# EAGLE design LiPoBatteryBreadboardSupply (EAGLE 8.2.2)
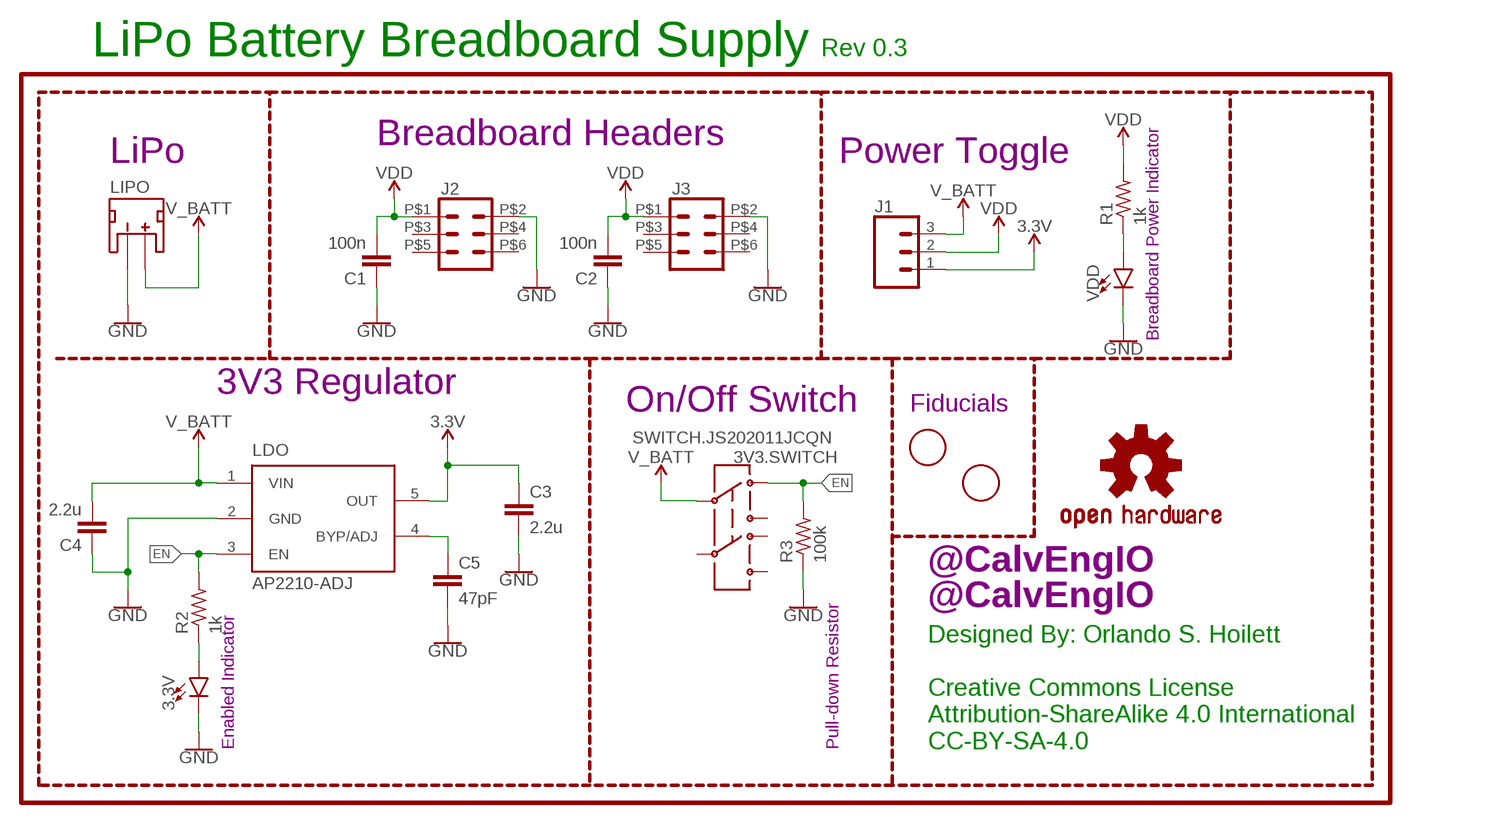
[diagram p0: schematic, sheet 1]

## Parts
3.3V  LED0603  [LED-0603]
3V3.SWITCH  SWITCH.JS202011JCQN  [SWITCH.00]
C1  100n  CAPACITOR0603  [C0603]
C2  100n  CAPACITOR0603  [C0603]
C3  2.2u  C-EUC0603  [C0603]
C4  2.2u  C-EUC0603  [C0603]
C5  47pF  C-EUC0402  [C0402]
FD1  FIDUCIAL  [FIDUCIAL_1MM]
FD2  FIDUCIAL  [FIDUCIAL_1MM]
J1  CONN_03  [1X03]
J2  JMP.03X2HEADERS  [JMP.03X2]
J3  JMP.03X2HEADERS  [JMP.03X2]
LDO  AP2210-ADJ  [SOT23-5]
LIPO  JST_2MM_MALE  [JST-2-SMD]
LOGO1  OSHW-LOGOS  [OSHW-LOGO-S]
R1  1k  R-US_R0402  [R0402]
R2  1k  R-US_R0402  [R0402]
R3  100k  R-US_R0402  [R0402]
U$1  HANDLE.1HANDLE.025  [HANDLE.025]
U$6  HANDLE.1HANDLE.08  [HANDLE.08]
VDD  LED0603  [LED-0603]

## Nets
3.3V: C3.1 J1.1 LDO.5(OUT)
EN: 3V3.SWITCH.1 LDO.3(EN) R2.2 R3.2
GND: 3.3V.C C1.1 C2.1 C3.2 C4.1 C5.2 J2.P$2 J3.P$2 LDO.2(GND) LIPO.1(-) R3.1 VDD.C
N$1: 3.3V.A R2.1
N$2: R1.1 VDD.A
N$4: C5.1 LDO.4(BYP/ADJ)
V_BATT: 3V3.SWITCH.2 C4.2 J1.3 LDO.1(VIN) LIPO.2(+)
VDD: C1.2 C2.2 J1.2 J2.P$1 J3.P$1 R1.2
Unconnected: 3V3.SWITCH.3 3V3.SWITCH.5 3V3.SWITCH.6 3V3.SWITCH.7 J2.P$3 J2.P$4 J2.P$5 J2.P$6 J3.P$3 J3.P$4 J3.P$5 J3.P$6 LIPO.NC1(PAD1) LIPO.NC2(PAD2)

## Notes on the sheet
- LiPo Battery Breadboard Supply | Rev 0.3
- Breadboard Headers
- LiPo | Power Toggle
- Breadboard Power Indicator
- 3V3 Regulator
- On/Off Switch | Fiducials
- Designed By: Orlando S. Hoilett
- Enabled Indicator | Pull-down Resistor
- Creative Commons License
  Attribution-ShareAlike 4.0 International
  CC-BY-SA-4.0

## Library data of the parts
3.3V VDD = CalvEngIO-LED:LED: LED (Generic) Standard schematic elements and footprints for 5mm, 3mm, 1206, and 0603 sized LEDs. Generic LEDs with no color specified.
3V3.SWITCH = CalvEngIO-Switches:SWITCH.JS202011JCQN
C1 C2 = CalvEngIO-Passives:CAPACITOR
C3-C5 = resistor:C-EU: CAPACITOR, European symbol
FD1 FD2 = adafruit:FIDUCIAL: For use by pick and place machines to calibrate the vision/machine, 1mm By microbuilder.eu
J1 = SparkFun-Connectors:CONN_03: Multi connection point. Often used as Generic Header-pin footprint for 0.1 inch spaced/style header connections On any of the 0.1 inch spaced packages, you can populate with these: Break Away Headers - Straight <https://www.sparkfun.com/products/116> (PRT-00116) Break Away Male Headers - Right Angle <https://www.sparkfun.com/products/553> (PRT-00553) Female Headers <https://www.sparkfun.com/products/115> (PRT-00115) Break Away Headers - Machine Pin <https://www.sparkfun.com/products/117> (PRT-00117) Break Away Female Headers - Swiss Machine Pin <https://www.sparkfun.com/products/743> (PRT-00743) Stackable Header - 3 Pin (Female, 0.1") <https://www.sparkfun.com/products/13875> (PRT-13875) For SCREWTERMINALS and SPRING TERMINALS visit here: Screw Terimnals on SparkFun.com <https://www.sparkfun.com/search/results?term=Screw+Terminals> (5mm/3.5mm/2.54mm spacing) This device is also useful as a general connection point to wire up your design to another part of your project. Our various solder wires solder well into these plated through hole pads. Hook-Up Wire - Assortment (Stranded, 22 AWG) <https://www.sparkfun.com/products/11375> (PRT-11375) Hook-Up Wire - Assortment (Solid Core, 22 AWG) <https://www.sparkfun.com/products/11367> (PRT-11367) View the entire wire category on our website here <https://www.sparkfun.com/categories/141> Special notes: Molex polarized connector foot print use with SKU : PRT-08232 with associated crimp pins and housings.
J2 J3 = CalvEngIO-Connectors:JMP.03X2: Multi connection point. Often used as Generic Header-pin footprint for 0.1 inch spaced/style header connections You can populate with any combo of single row headers, but if you'd like an exact match, check these: Header - 2x3 (Male, 0.1") <https://www.sparkfun.com/products/12807> (PRT-12807) Header - 2x3 (Female, 0.1") <https://www.sparkfun.com/products/13010> (PRT-13010) 2x3 Pin Shrouded Header <https://www.sparkfun.com/products/10877> (PRT-10877) On any of the 0.1 inch spaced packages, you can populate with these: Break Away Headers - Straight <https://www.sparkfun.com/products/116> (PRT-00116) Break Away Male Headers - Right Angle <https://www.sparkfun.com/products/553> (PRT-00553) Female Headers <https://www.sparkfun.com/products/115> (PRT-00115) Break Away Headers - Machine Pin <https://www.sparkfun.com/products/117> (PRT-00117) Break Away Female Headers - Swiss Machine Pin <https://www.sparkfun.com/products/743> (PRT-00743) Special note: the shrouded connector mates well with our 3x2 ribbon cables: Ribbon Crimp Connector - 6-pin (2x3, Female) <https://www.sparkfun.com/products/10651> (PRT-10651) Ribbon Cable - 6 wire (15ft) <https://www.sparkfun.com/products/10646> (PRT-10646); PROD_ID: HW-11044
LDO = CalvEngIO-Power:AP2210-ADJ
LIPO = SparkFun-Connectors:JST_2MM_MALE: JST 2MM MALE RA CONNECTOR Two pin, compact surface mount connector. Commonly used as a battery input connection point. We really like the solid locking feeling and high current rating on these small connectors. We use these all the time as battery connectors. Mates to single-cell LiPo batteries. Here is the connector we sell at SparkFun: JST Right Angle Connector - White <https://www.sparkfun.com/products/8612> (PRT-08612) Datasheet <http://www.sparkfun.com/datasheets/Prototyping/Connectors/JST-Horizontal.pdf> It was used on these SparkFun products: SparkFun MOSFET Power Controller <https://www.sparkfun.com/products/11214> (PRT-11214) SparkFun Battery Babysitter - LiPo Battery Manager <https://www.sparkfun.com/products/13777> (PRT-13777) And many, many others that required a lipo battery connection.; PROD_ID: CONN-11443; SF_ID: PRT-08612
LOGO1 = SparkFun-Aesthetics:OSHW-LOGO: Open-Source Hardware (OSHW) Logo This logo indicates the piece of hardware it is found on incorporates a OSHW license and/or adheres to the definition of open source hardware found here: http://freedomdefined.org/OSHW
R1-R3 = resistor:R-US_: RESISTOR, American symbol
U$1 U$6 = CalvEngIO-Logos:HANDLE.1

## Board
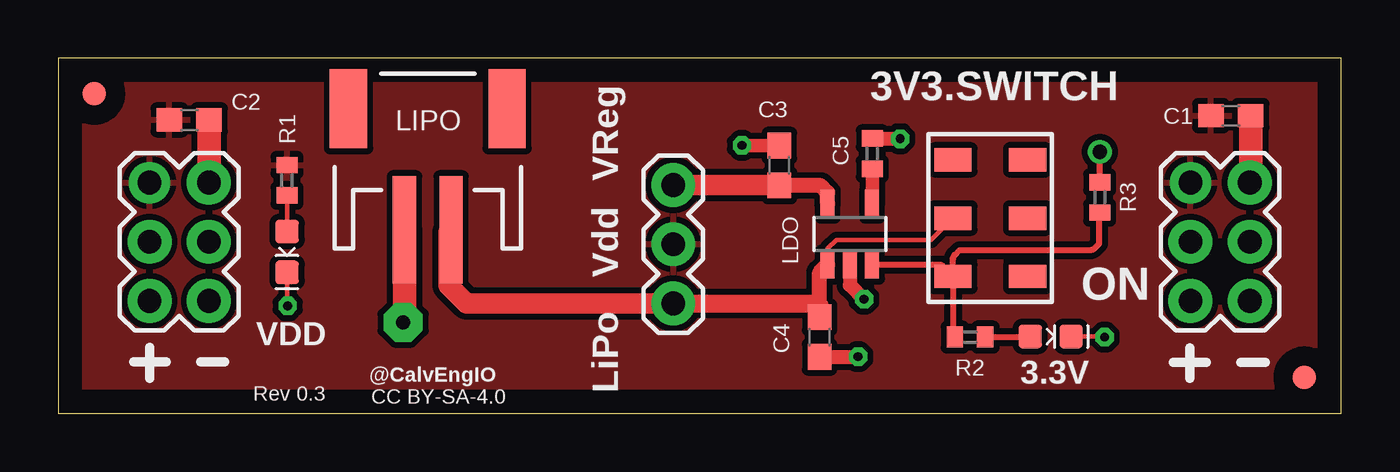
[diagram p1: board, top side]
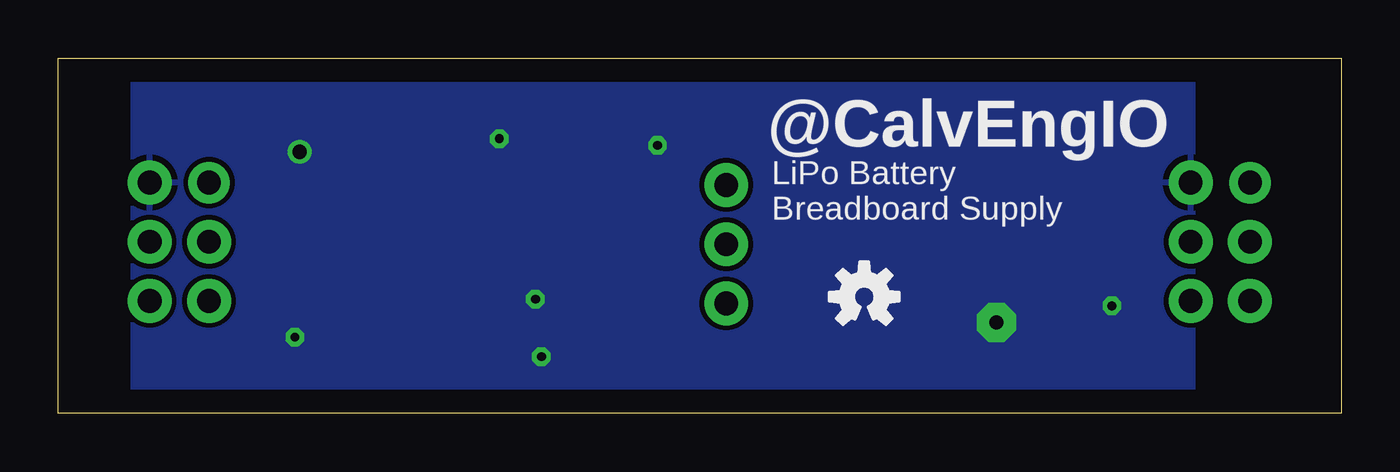
[diagram p2: board, bottom side, seen from below]

Size 55 x 15.24 mm. Coordinates in mm from the lower left corner, seen from the top.
Outline: 0,0 55,0 55,15.24 0,15.24 0,0
Copper layers (1*16): Top 0.035mm / dielectric 1.5mm / Bottom 0.035mm
Design rules "default": minimum track width 10mil, minimum drill 24mil, track to track 8mil, track to pad 8mil, pad to pad 8mil, via to via 8mil, smd to smd 8mil, copper to edge 40mil, drill to drill 8mil, minimum pad ring 10mil, minimum via ring 8mil, stop-mask expansion 4mil, vias tented up to drill 0mil, thermal gap 10mil

### Footprints (pad centres in the part's own frame; a part is rotated, then mirrored left to right if it is on the bottom)
LED-0603 = smd 1 x 1: A -0.877,0; C 0.877,0
SWITCH.00 = smd 1 x 1.6: 1 -2.5,1.6; 2 0,1.6; 3 2.5,1.6; 5 -2.5,-1.6; 6 0,-1.6; 7 2.5,-1.6
C0603 = smd 1.1 x 1: 1 -0.85,0; 2 0.85,0
C0402 = smd 0.7 x 0.9: 1 -0.65,0; 2 0.65,0
FIDUCIAL_1MM = smd 1 x 1: 1 0,0
1X03 = drill 1.016 pad 1.88: 1 0,0; 2 2.54,0; 3 5.08,0
JMP.03X2 = drill 1.016 pad 1.778: P$1 0,0 | drill 1.016 pad 1.88: P$2 0,2.54; P$3 2.54,0; P$4 2.54,2.54; P$5 5.08,0; P$6 5.08,2.54
SOT23-5 = smd 0.6 x 1.2: 1 -0.95,-1.306; 2 0,-1.306; 3 0.95,-1.306; 4 0.95,1.306; 5 -0.95,1.306
JST-2-SMD = smd 1 x 4.6: 1 -1,-3.7; 2 1,-3.7 | smd 1.6 x 3.4: NC1 -3.4,1.5; NC2 3.4,1.5
R0402 = smd 0.7 x 0.9: 1 -0.65,0; 2 0.65,0

### Placement (x,y rotation side)
3.3V  42.55,3.3 0 top
3V3.SWITCH  39.95,8.38 90 top
C1  50.27,12.78 180 top
C2  5.61,12.6 180 top
C3  30.91,10.64 90 top
C4  32.64,3.28 90 top
C5  34.9,11.15 90 top
FD1  1.55,13.72 0 top
FD2  53.42,1.55 0 top
J1  26.37,9.8 270 top
J2  3.91,9.91 270 top
J3  48.54,9.91 270 top
LDO  33.93,7.7 0 top
LIPO  15.84,11.58 0 top
LOGO1  20.45,5 0 bottom
R1  9.8,10.01 90 top
R2  39.09,3.28 180 top
R3  44.65,9.27 270 top
U$1  15.88,1.35 0 top
U$6  16.23,12.7 0 bottom
VDD  9.8,6.93 270 top

### Tracks (layer width: path | path; a pad name or v marks a point on that pad's centre or on a via)
3.3V
  Top 0.635: LDO.5 32.98,9.48 32.69,9.78 30.93,9.78 C3.1
  Top 0.889: J1.1 30.9,9.8 C3.1
EN
  Top 0.203: 38.28,3.29 R2.2
  Top 0.254: LDO.3 37.74,6.39 arc-45 37.92,6.32 3V3.SWITCH.1 | 3V3.SWITCH.1 38.35,3.47 arc45 R2.2 | 44.63,8.56 arc-45 R3.2 arc45 44.63,8.56 | 3V3.SWITCH.1 38.35,6.63 arc-45 38.43,6.81 38.63,7.01 44.24,7.01 arc45 44.42,7.08 44.63,7.29 44.63,8.56
GND  (via drill 0.38, 0.6 pad 1.68, 0.61)
  Top 0.203: VDD.C 9.8,4.65 v9.83,4.62 | 3.3V.C 44.83,3.3 v44.86,3.28
  Top 0.254: R3.1 v44.65,11.23
  Top 0.584: C3.2 29.32,11.49 v29.31,11.51
  Top 0.61: LDO.2 33.93,5.51 v34.54,4.9 | C4.1 34.28,2.43 v34.29,2.44 | C5.2 36.08,11.8 v36.09,11.79
  Top 1.016: LIPO.1 14.84,3.97 v14.78,3.91 | C1.1 51.12,10 arc-45 J3.P$2 | C2.1 6.46,9.93 arc-45 J2.P$2
  pour Bottom (isolate 0.203): 6.35,15.24 51.82,15.24 51.82,0 6.35,0
N$1
  Top 0.254: R2.1 41.61,3.28 arc45 3.3V.A
N$2
  Top 0.203: R1.1 VDD.A
N$4
  Top 0.584: C5.1 34.9,9.02 LDO.4
V_BATT
  Top 0.203: LDO.1 32.98,7.08 33.35,7.44 37.41,7.44 3V3.SWITCH.2 | 3V3.SWITCH.2
  Top 0.635: 32.62,4.14 C4.2 32.64,4.62 32.64,6.04 LDO.1
  Top 0.762: J1.3 32.54,4.72 32.64,4.62
  Top 0.889: J1.3 17.5,4.72 16.74,5.49 16.74,7.78 LIPO.2
VDD
  pour Top (isolate 0.254): 0,15.24 55,15.24 55,0 0,0

### Text on the board
tPlace: ON | Rev 0.3 | CC BY-SA-4.0
tNames: VReg | Vdd | LiPo
bNames: LiPo Battery / Breadboard Supply